# Altium schematic sheet ESP8266_2022-02-20.schdoc
size 59 x 53 mm
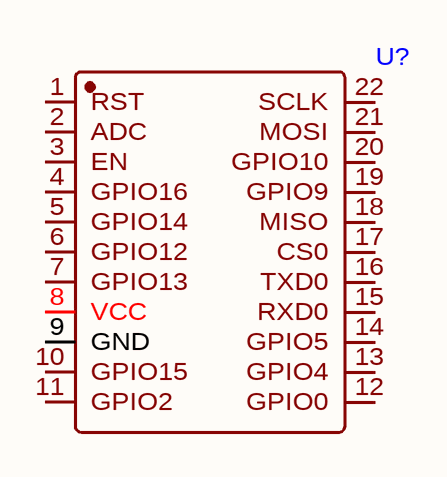
[diagram p0: ESP8266_2022-02-20.schdoc]

## Parts
U?  (no value)  [WIFIM-SMD_ESP-12F-ESP8266MOD]

## Nets

Not connected (* = marked no-connect by the designer): U? 1(RST) 2(ADC) 3(EN) 4(GPIO16) 5(GPIO14) 6(GPIO12) 7(GPIO13) 8(VCC) 9(GND) 10(GPIO15) 11(GPIO2) 12(GPIO0) 13(GPIO4) 14(GPIO5) 15(RXD0) 16(TXD0) 17(CS0) 18(MISO) 19(GPIO9) 20(GPIO10) 21(MOSI) 22(SCLK)

## Library data of the parts
U? = ESP8266